# Altium project driverV1.0.PrjPcb
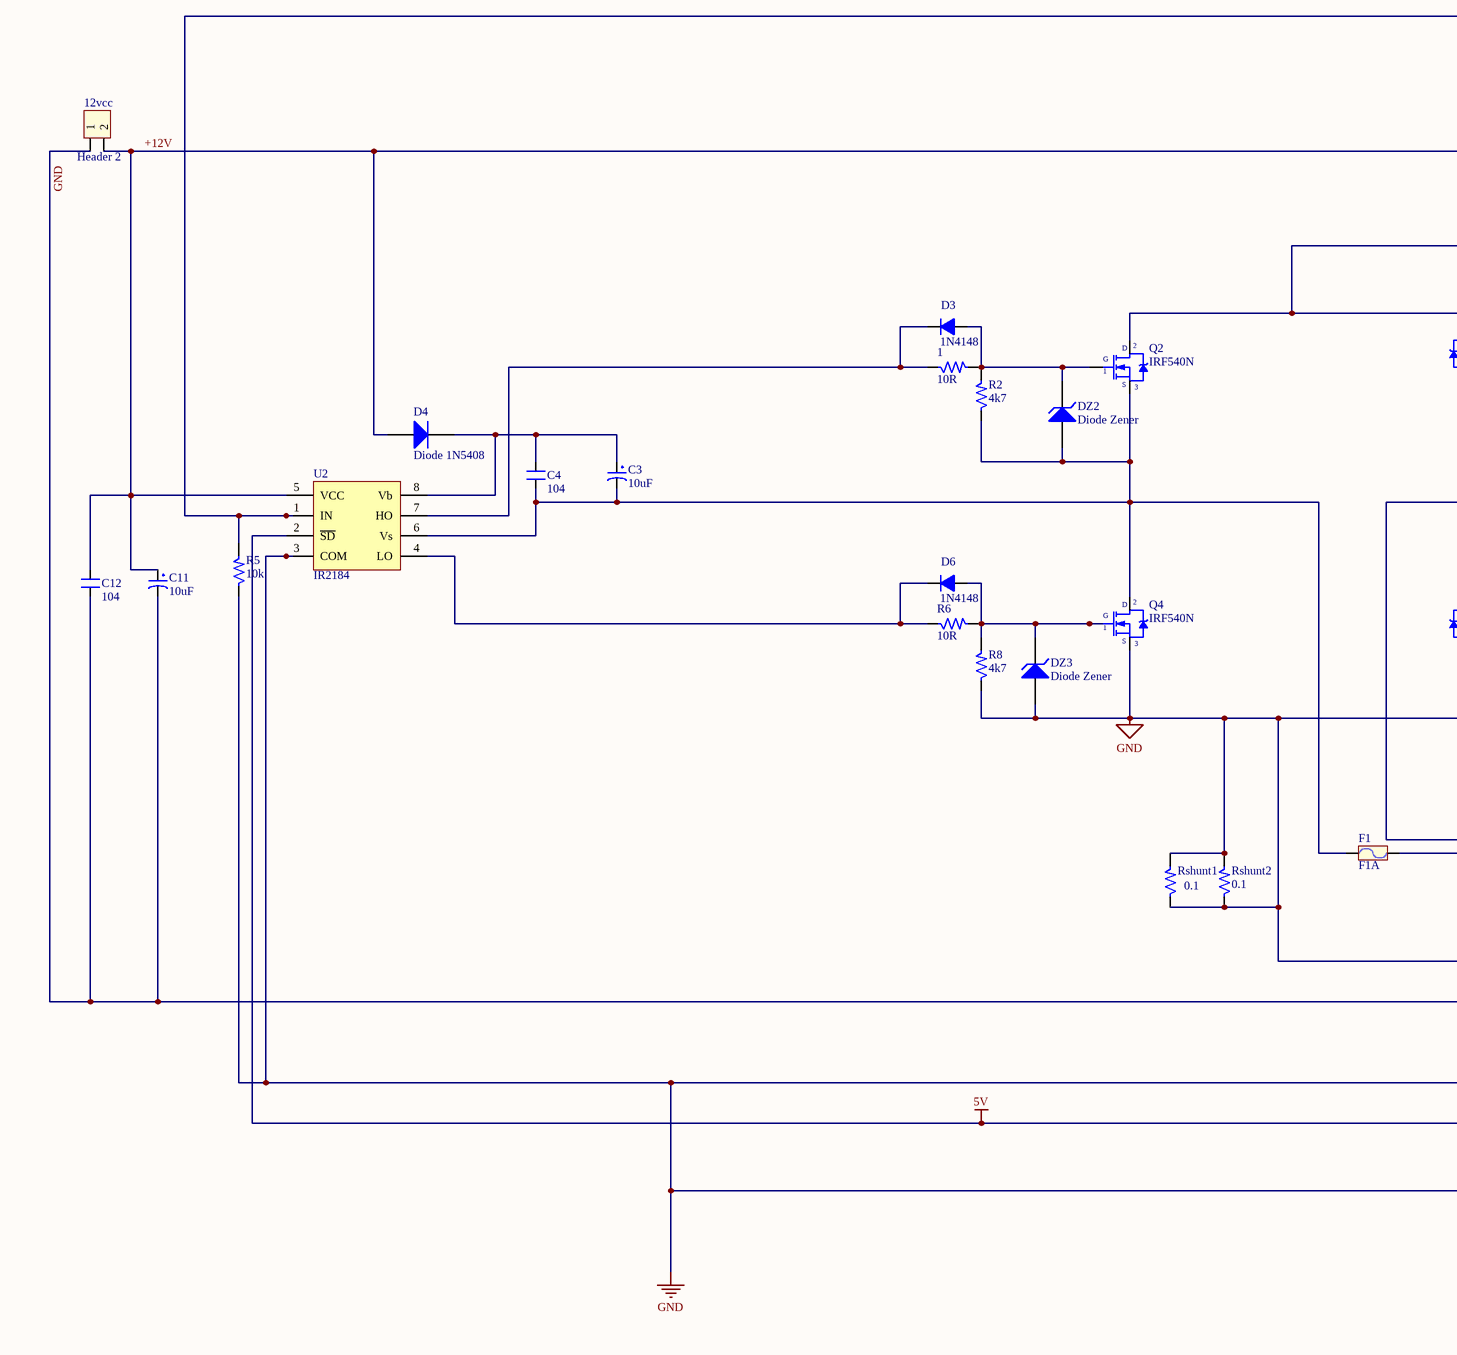
[diagram p0: driverV1.0.SchDoc, left]
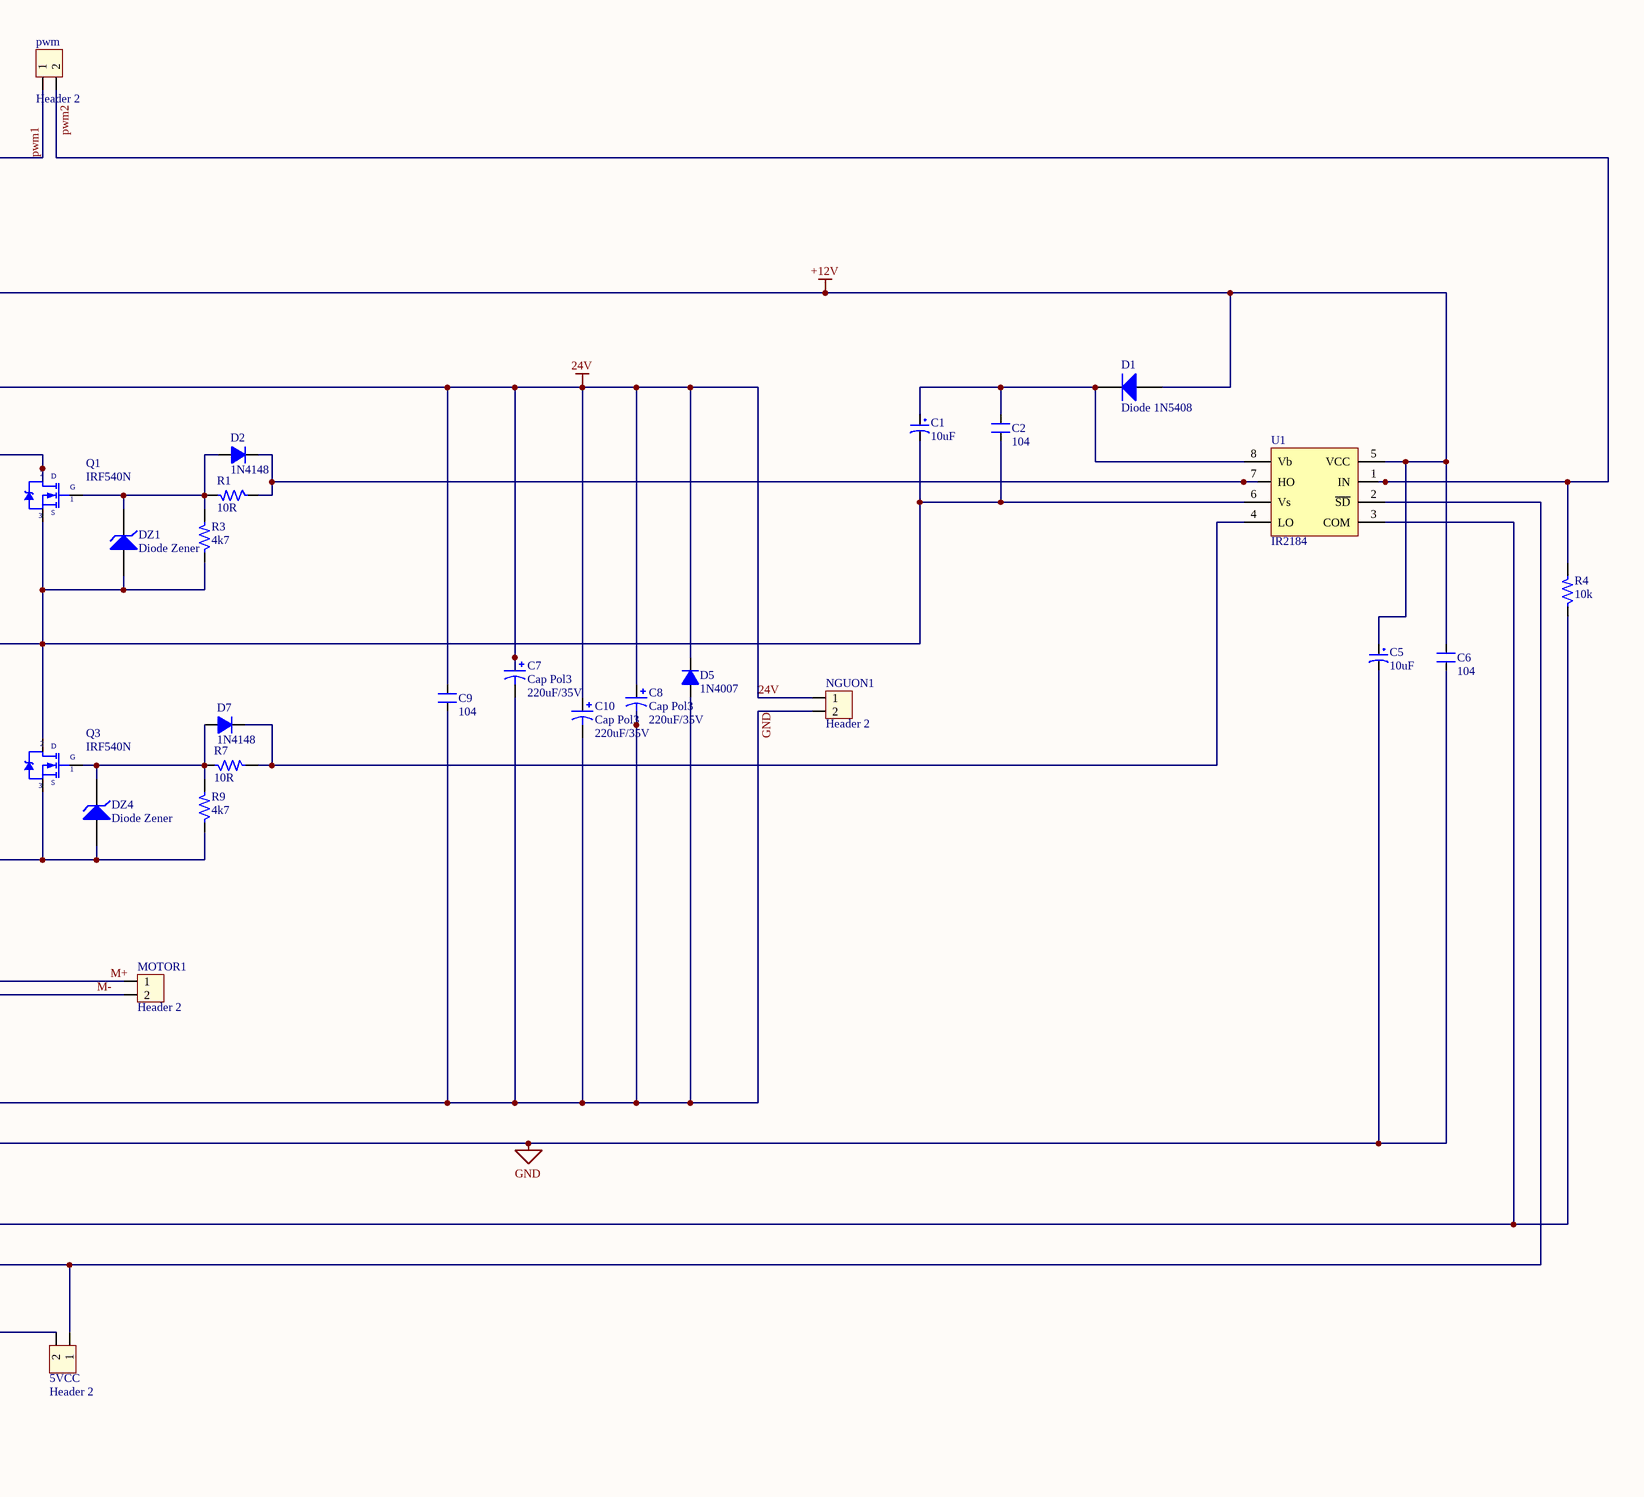
[diagram p1: driverV1.0.SchDoc, right]
1 sheet, 47 parts. Net scope: global (net labels, ports and power ports of the same name join across sheets).
Board file: PCBpower.PcbDoc

## Sheet driverV1.0.SchDoc
size A1

### Parts
1  10R  [SM-1206]
5VCC  Header 2  [HED2]
12vcc  Header 2  [HED2]
C1  10uF  [CP1/2]
C2  104  [SM-0805]
C3  10uF  [CP1/2]
C4  104  [SM-0805]
C5  10uF  [CP1/2]
C6  104  [SM-0805]
C7  Cap Pol3  value 220uF/35V  [CP2/5]
C8  Cap Pol3  value 220uF/35V  [CP2/5]
C9  104  [SM-0805]
C10  Cap Pol3  value 220uF/35V  [CP2/5]
C11  10uF  [CP1/2]
C12  104  [SM-0805]
D1  Diode 1N5408  [DO-201AD]
D2  1N4148  [D1A]
D3  1N4148  [D1A]
D4  Diode 1N5408  [DO-201AD]
D5  1N4007  [D1A]
D6  1N4148  [D1A]
D7  1N4148  [D1A]
DZ1  Diode Zener  [DIODE/NOM/0.5A]
DZ2  Diode Zener  [DIODE/NOM/0.5A]
DZ3  Diode Zener  [DIODE/NOM/0.5A]
DZ4  Diode Zener  [DIODE/NOM/0.5A]
F1  F1A  [Fuse]
MOTOR1  Header 2  [HED2]
NGUON1  Header 2  [HED2]
pwm  Header 2  [HED2]
Q1  IRF540N  [QTO-220]
Q2  IRF540N  [QTO-220]
Q3  IRF540N  [QTO-220]
Q4  IRF540N  [QTO-220]
R1  10R  [SM-1206]
R2  4k7  [SM-1206]
R3  4k7  [SM-1206]
R4  10k  [SM-1206]
R5  10k  [SM-1206]
R6  10R  [SM-1206]
R7  10R  [SM-1206]
R8  4k7  [SM-1206]
R9  4k7  [SM-1206]
Rshunt1  0.1  [SM-1206]
Rshunt2  0.1  [SM-1206]
U1  IR2184  [SOIC127P490X600X175-8N]
U2  IR2184  [SOIC127P490X600X175-8N]

### Nets
5V: 5VCC.1 U1.2(~{SD}) U2.2(~{SD})
24V: C7.1 C8.1 C9.2 C10.1 D5.2(K) NGUON1.1 Q1.2(D) Q2.2(D)
+12V: 12vcc.2 C5.1 C6.2 C11.1 C12.2 D1.1(A) D4.1(A) U1.5(VCC) U2.5(VCC)
GND: 5VCC.2 12vcc.1 C5.2 C6.1 C7.2 C8.2 C9.1 C10.2 C11.2 C12.1 D5.1(A) DZ3.1(A) DZ4.1(A) NGUON1.2 Q3.3(S) Q4.3(S) R4.1 R5.1 R8.1 R9.1 Rshunt1.1 Rshunt1.2 Rshunt2.1 Rshunt2.2 U1.3(COM) U2.3(COM)
M+: C1.2 C2.1 DZ1.1(A) MOTOR1.1 Q1.3(S) Q3.2(D) R3.1 U1.6(Vs)
M-: F1.2 MOTOR1.2
pwm1: pwm.1 R5.2 U2.1(IN)
pwm2: pwm.2 R4.2 U1.1(IN)
Net1_1: 1.1 D3.2(K) U2.7(HO)
Net1_2: 1.2 D3.1(A) DZ2.2(K) Q2.1(G) R2.2
NetC1_1: C1.1 C2.2 D1.2(K) U1.8(Vb)
NetC3_1: C3.1 C4.2 D4.2(K) U2.8(Vb)
NetC3_2: C3.2 C4.1 DZ2.1(A) F1.1 Q2.3(S) Q4.2(D) R2.1 U2.6(Vs)
NetD2_1: D2.1(A) DZ1.2(K) Q1.1(G) R1.2 R3.2
NetD2_2: D2.2(K) R1.1 U1.7(HO)
NetD6_1: D6.1(A) DZ3.2(K) Q4.1(G) R6.2 R8.2
NetD6_2: D6.2(K) R6.1 U2.4(LO)
NetD7_1: D7.1(A) DZ4.2(K) Q3.1(G) R7.1 R9.2
NetD7_2: D7.2(K) R7.2 U1.4(LO)

### Notes on the sheet
- Title
- Size:
- Date:
- File:
- A1
- Number:
- Time:
- Revision:
- Sheet
- of

### Library data of the parts
1 R1-R9 Rshunt1 Rshunt2 = R: Resistor 1/4W; Value: R1/4W - 1K
5VCC 12vcc MOTOR1 NGUON1 pwm = Hed2: Header 2 (Green); Value: Header 2
C1 C3 C5 C11 = CP1: Cap P  0,1uF < 22uF , 16 - 50V; Value: 10uF/50V; Description 1: 10 => 220uF/6,3V/10V - 10uF => 100uF/16V; Description 2: 0,1uF => 33uF/50V - 10uF => 22uF/63V; Description 3: 0,47uF => 10uF/100V
C2 C4 C6 C9 C12 = CM: Cap SMD; Value: 103
C7 C8 C10 = Cap Pol3: Polarized Capacitor (Surface Mount); VALUE: C?; LatestRevisionDate: 17-Jul-2002; LatestRevisionNote: Re-released for DXP Platform.; PackageReference: C0805; Publisher: Altium Limited
D1 D4 = Diode 1N5408: 3 Amp Medium Power Silicon Rectifier Diode; Published: 8-Jun-2000; LatestRevisionDate: 17-Jul-2002; LatestRevisionNote: Re-released for DXP Platform.; DatasheetVersion: Aug-1984; PackageReference: DO-201AD; Publisher: Altium Limited; PackageDescription: Diode, Axial; Body 9.5 x 5.3 mm (LxDia. max), Lead Dia. 1.32 mm (max); ComponentLink1Description: Manufacturer Link; ComponentLink1URL: http://www.irf.com/
D2 D3 D6 D7 = D1A: Diode 1A; Value: 1N4007
D5 = D1A: Diode 1A; Value: 1N4007
DZ1-DZ4 = Diode Zener: Zener Diode; Published: 8-Jun-2000; LatestRevisionDate: 17-Jul-2002; LatestRevisionNote: Re-released for DXP Platform.; PackageReference: DIODE-0.7; Publisher: Altium Limited
F1 = Fuse: Designed by: VanDungEvn; Value: Fuse
Q1-Q4 = IRF840: MOSFET N - CHANNEL 500V - 0.75 - 8A - TO-220; Value: IRF840
U1 U2 = IR2184: Half-Bridge Driver